# EAGLE board sr42-revB-kbd (EAGLE 9.6.2)
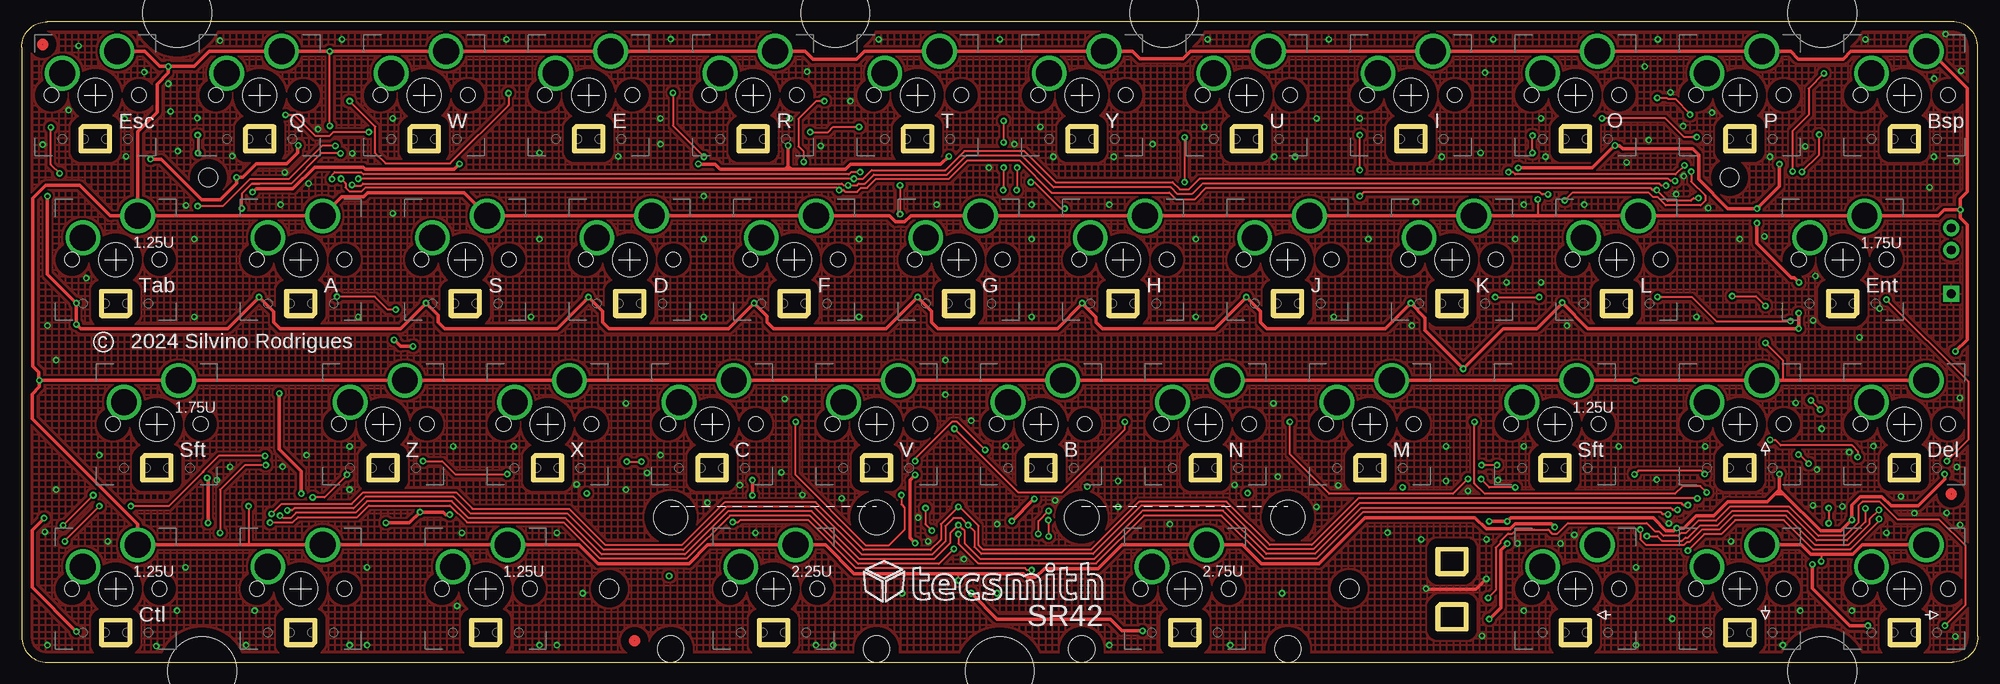
[diagram p3: board, top side]
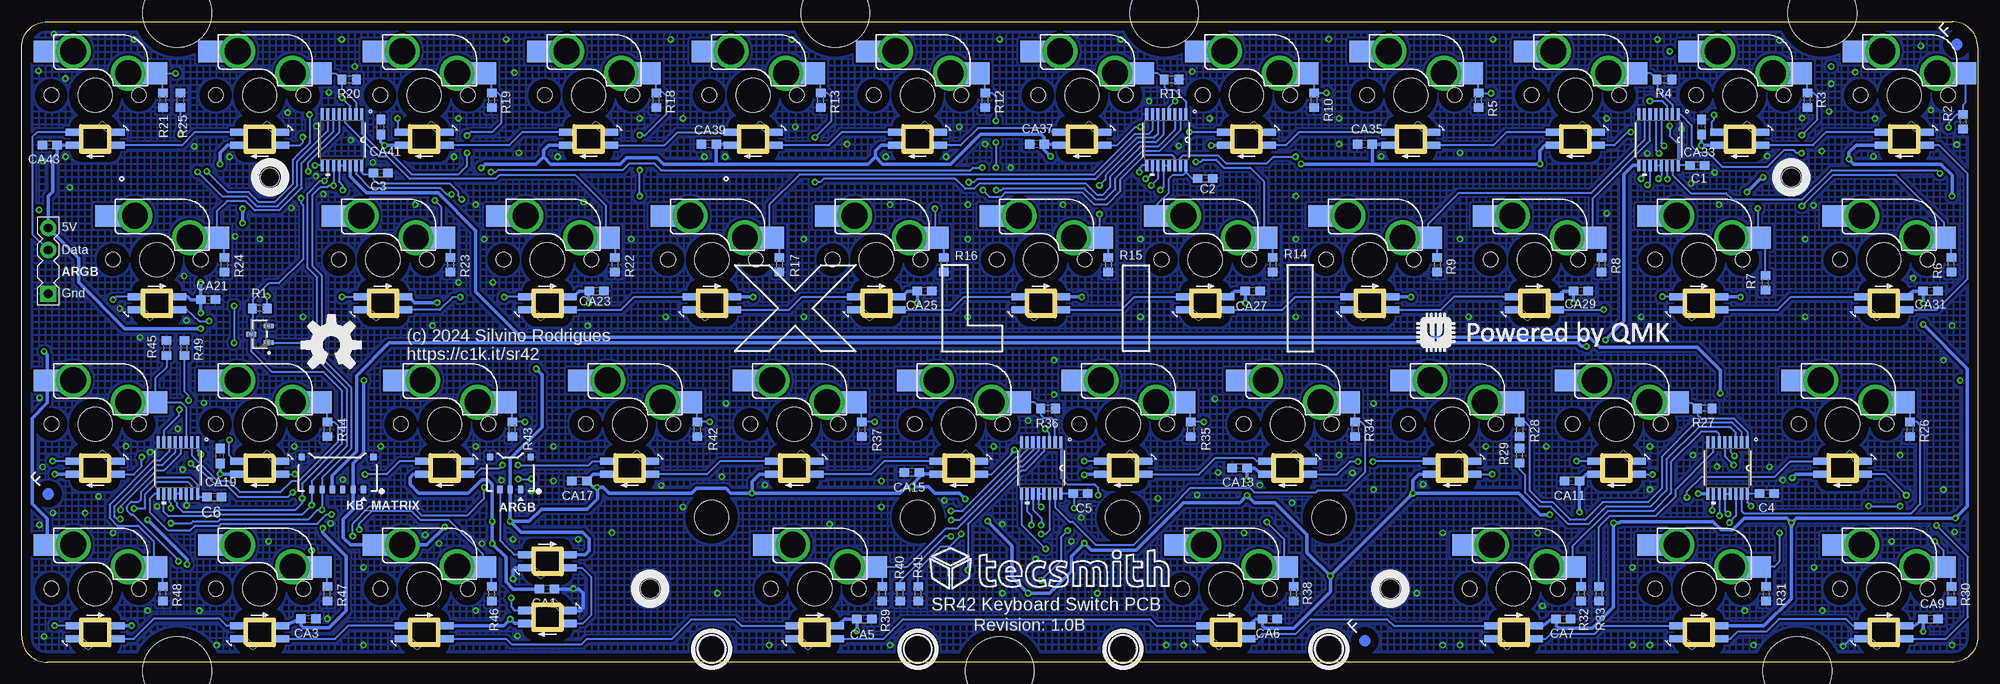
[diagram p4: board, bottom side, seen from below]

Size 226.6 x 74.2 mm. Coordinates in mm from the lower left corner, seen from the top.
Outline: 3,0 223.6,0 arc90 226.6,3 226.6,71.2 arc90 223.6,74.2 3,74.2 arc90 0,71.2 0,3 arc90 3,0
Copper layers (1*16): Top 0.035mm / dielectric 1.5mm / Bottom 0.035mm
Design rules "default *": minimum track width 6mil, minimum drill 0.35mm, track to track 10mil, track to pad 10mil, pad to pad 10mil, via to via 10mil, smd to smd 10mil, copper to edge 40mil, drill to drill 6mil, minimum pad ring 10mil, minimum via ring 8mil, stop-mask expansion 4mil, vias tented up to drill 0mil, thermal gap 10mil
Net classes: 2 gnd: width 0.254 mm
Holes 2.2 mm at 21.62,56.15 197.83,56.15 68.06,8.53 153.78,8.53
Holes 8 mm at 18.05,75.2 20.91,-1 94.25,75.2 113.3,-1 208.55,-1 208.55,75.2 132.35,75.2

## Footprints (pad centres in the part's own frame; a part is rotated, then mirrored left to right if it is on the bottom)
SK6812-E-MILL_V2 = smd 1.8 x 0.82 bottom: 1-VDD 2.5,-0.75; 2-DOUT 2.5,0.75; 3-GND -2.5,0.75; 4-DIN -2.5,-0.75
MOLEX_781710003 = smd 0.6 x 0.85: 1 -1.2,2; 2 0,2; 3 1.2,2 | smd 0.7 x 0.8: NC1 -2.35,-1.775; NC2 2.35,-1.775
C0603 = smd 1.1 x 1: 1 -0.85,0; 2 0.85,0
MX-STABS-200U = hole 3.988: -11.938,8.255; 11.938,8.255 | hole 3.048: -11.938,-6.985; 11.938,-6.985
ARGB = drill 1.016 pad 1.88: D 2.54,0; V 0,0 | drill 1.016 pad 1.88 square: G 7.62,0
MOLEX_781710006 = smd 0.6 x 0.85: 1 -3,2; 2 -1.8,2; 3 -0.6,2; 4 0.6,2; 5 1.8,2; 6 3,2 | smd 0.7 x 0.8: NC1 -4.15,-1.775; NC2 4.15,-1.775
TSSOP16 = smd 1.408 x 0.356: 1 -2.952,2.275; 2 -2.952,1.625; 3 -2.952,0.975; 4 -2.952,0.325; 5 -2.952,-0.325; 6 -2.952,-0.975; 7 -2.952,-1.625; 8 -2.952,-2.275; 9 2.952,-2.275; 10 2.952,-1.625; 11 2.952,-0.975; 12 2.952,-0.325; 13 2.952,0.325; 14 2.952,0.975; 15 2.952,1.625; 16 2.952,2.275
R0603 = smd 1 x 1.1: 1 -0.85,0; 2 0.85,0
MX-5-PIN-HOTSWAP-PAD = smd 3.15 x 2.5 bottom: 1@1 -6.785,2.54; 2@1 5.542,5.08 | drill 3 pad 3.75: 1@2 -3.81,2.54; 2@2 2.54,5.08 | hole 3.988: 0,0 | hole 1.7: -5.08,0; 5.08,0
TO-236AB_NEX = smd 0.533 x 1.168: 1 -0.953,-1.029; 2 0.953,-1.029; 3 0,1.029

## Placement (x,y rotation side)
A1  SK6812-E-REVERSE_V2  [SK6812-E-MILL_V2]  165.69,11.7 180 top
A1.5  SK6812-E-REVERSE_V2  [SK6812-E-MILL_V2]  165.69,5.25 0 top
A2  SK6812-E-REVERSE_V2  [SK6812-E-MILL_V2]  218.07,3.47 180 top
A3  SK6812-E-REVERSE_V2  [SK6812-E-MILL_V2]  199.03,3.47 180 top
A4  SK6812-E-REVERSE_V2  [SK6812-E-MILL_V2]  179.97,3.47 180 top
A5  SK6812-E-REVERSE_V2  [SK6812-E-MILL_V2]  134.73,3.47 180 top
A6  SK6812-E-REVERSE_V2  [SK6812-E-MILL_V2]  87.11,3.47 180 top
A7  SK6812-E-REVERSE_V2  [SK6812-E-MILL_V2]  53.77,3.47 180 top
A8  SK6812-E-REVERSE_V2  [SK6812-E-MILL_V2]  32.34,3.47 180 top
A9  SK6812-E-REVERSE_V2  [SK6812-E-MILL_V2]  10.91,3.47 180 top
A10  SK6812-E-REVERSE_V2  [SK6812-E-MILL_V2]  15.67,22.52 0 top
A11  SK6812-E-REVERSE_V2  [SK6812-E-MILL_V2]  41.86,22.52 0 top
A12  SK6812-E-REVERSE_V2  [SK6812-E-MILL_V2]  60.91,22.52 0 top
A13  SK6812-E-REVERSE_V2  [SK6812-E-MILL_V2]  79.96,22.52 0 top
A14  SK6812-E-REVERSE_V2  [SK6812-E-MILL_V2]  99.01,22.52 0 top
A15  SK6812-E-REVERSE_V2  [SK6812-E-MILL_V2]  118.06,22.52 0 top
A16  SK6812-E-REVERSE_V2  [SK6812-E-MILL_V2]  137.11,22.52 0 top
A17  SK6812-E-REVERSE_V2  [SK6812-E-MILL_V2]  156.16,22.52 0 top
A18  SK6812-E-REVERSE_V2  [SK6812-E-MILL_V2]  177.59,22.52 0 top
A19  SK6812-E-REVERSE_V2  [SK6812-E-MILL_V2]  199.03,22.52 0 top
A20  SK6812-E-REVERSE_V2  [SK6812-E-MILL_V2]  218.07,22.52 0 top
A21  SK6812-E-REVERSE_V2  [SK6812-E-MILL_V2]  210.93,41.58 180 top
A22  SK6812-E-REVERSE_V2  [SK6812-E-MILL_V2]  184.74,41.58 180 top
A23  SK6812-E-REVERSE_V2  [SK6812-E-MILL_V2]  165.69,41.58 180 top
A24  SK6812-E-REVERSE_V2  [SK6812-E-MILL_V2]  146.64,41.58 180 top
A25  SK6812-E-REVERSE_V2  [SK6812-E-MILL_V2]  127.59,41.58 180 top
A26  SK6812-E-REVERSE_V2  [SK6812-E-MILL_V2]  108.54,41.58 180 top
A27  SK6812-E-REVERSE_V2  [SK6812-E-MILL_V2]  89.49,41.58 180 top
A28  SK6812-E-REVERSE_V2  [SK6812-E-MILL_V2]  70.44,41.58 180 top
A29  SK6812-E-REVERSE_V2  [SK6812-E-MILL_V2]  51.39,41.58 180 top
A30  SK6812-E-REVERSE_V2  [SK6812-E-MILL_V2]  32.34,41.58 180 top
A31  SK6812-E-REVERSE_V2  [SK6812-E-MILL_V2]  10.91,41.58 180 top
A32  SK6812-E-REVERSE_V2  [SK6812-E-MILL_V2]  8.53,60.62 0 top
A33  SK6812-E-REVERSE_V2  [SK6812-E-MILL_V2]  27.57,60.62 0 top
A34  SK6812-E-REVERSE_V2  [SK6812-E-MILL_V2]  46.62,60.62 0 top
A35  SK6812-E-REVERSE_V2  [SK6812-E-MILL_V2]  65.67,60.62 0 top
A36  SK6812-E-REVERSE_V2  [SK6812-E-MILL_V2]  84.72,60.62 0 top
A37  SK6812-E-REVERSE_V2  [SK6812-E-MILL_V2]  103.78,60.62 0 top
A38  SK6812-E-REVERSE_V2  [SK6812-E-MILL_V2]  122.83,60.62 0 top
A39  SK6812-E-REVERSE_V2  [SK6812-E-MILL_V2]  141.88,60.62 0 top
A40  SK6812-E-REVERSE_V2  [SK6812-E-MILL_V2]  160.93,60.62 0 top
A41  SK6812-E-REVERSE_V2  [SK6812-E-MILL_V2]  179.97,60.62 0 top
A42  SK6812-E-REVERSE_V2  [SK6812-E-MILL_V2]  199.03,60.62 0 top
A43  SK6812-E-REVERSE_V2  [SK6812-E-MILL_V2]  218.07,60.62 0 top
ARGB  MOLEX_0781710003  [MOLEX_781710003]  170,22 180 bottom
C1  100nF  [C0603]  32.5,57.55 0 bottom
C2  100nF  [C0603]  89.5,56.05 0 bottom
C3  100nF  [C0603]  185,56.65 0 bottom
C4  100nF  [C0603]  24.45,19.55 0 bottom
C5  100nF  [C0603]  103.95,19.55 0 bottom
C6  100nF  [C0603]  204.3,19.15 0 bottom
CA1  1uF  [C0603]  165.76,8.48 0 bottom
CA3  1uF  [C0603]  193.38,5.05 0 bottom
CA5  1uF  [C0603]  129,5 0 bottom
CA6  1uF  [C0603]  82,5 0 bottom
CA7  1uF  [C0603]  48,5 0 bottom
CA9  1uF  [C0603]  5.5,5 0 bottom
CA11  1uF  [C0603]  47,21 180 bottom
CA13  1uF  [C0603]  85.5,22.5 180 bottom
CA15  1uF  [C0603]  123.5,22 180 bottom
CA17  1uF  [C0603]  162,21 180 bottom
CA19  1uF  [C0603]  203.6,23.9 90 bottom
CA21  1uF  [C0603]  205,42 0 bottom
CA23  1uF  [C0603]  160,43 0 bottom
CA25  1uF  [C0603]  122,43 0 bottom
CA27  1uF  [C0603]  84,43 0 bottom
CA29  1uF  [C0603]  46,43 0 bottom
CA31  1uF  [C0603]  5.5,43 0 bottom
CA33  1uF  [C0603]  32,62 90 bottom
CA35  1uF  [C0603]  71,60 180 bottom
CA37  1uF  [C0603]  109,60 180 bottom
CA39  1uF  [C0603]  147,60 180 bottom
CA41  1uF  [C0603]  185,62 90 bottom
CA43  1uF  [C0603]  223.33,59.9 180 bottom
H_SPC_1  MX-STABS-200U  [MX-STABS-200U]  87.11,8.53 0 top
H_SPC_2  MX-STABS-200U  [MX-STABS-200U]  134.73,8.53 0 top
I44  ARGB  [ARGB]  223.5,50.3 270 bottom
KB_MATRIX  MOLEX_0781710006  [MOLEX_781710006]  190,22 180 bottom
LOGO1  OSHW-LOGOL  [OSHW-LOGO-L]  190.71,36.76 0 bottom
M0  74HC589A_DT  [TSSOP16]  37,60.5 270 bottom
M1  74HC589A_DT  [TSSOP16]  94,60.5 270 bottom
M2  74HC589A_DT  [TSSOP16]  189.5,60.5 270 bottom
M3  74HC589A_DT  [TSSOP16]  29,22.5 270 bottom
M4  74HC589A_DT  [TSSOP16]  108.5,22.5 270 bottom
M5  74HC589A_DT  [TSSOP16]  208.5,22.5 270 bottom
R1  5.1K  [R0603]  199,41 0 bottom
R2  10K  [R0603]  1.7,62.6 90 bottom
R3  10K  [R0603]  19.75,65.1 90 bottom
R4  10K  [R0603]  36.3,67.5 180 bottom
R5  10K  [R0603]  57.85,65.1 90 bottom
R6  10K  [R0603]  3.08,46.05 270 bottom
R7  10K  [R0603]  24.61,43.95 270 bottom
R8  10K  [R0603]  43.56,46.05 270 bottom
R9  10K  [R0603]  62.61,46.05 270 bottom
R10  10K  [R0603]  76.9,65.1 90 bottom
R11  10K  [R0603]  93.4,67.5 180 bottom
R12  10K  [R0603]  115,65.1 90 bottom
R13  10K  [R0603]  134.05,65.1 90 bottom
R14  10K  [R0603]  81.66,46.05 270 bottom
R15  10K  [R0603]  100.71,46.05 270 bottom
R16  10K  [R0603]  119.76,46.05 270 bottom
R17  10K  [R0603]  138.81,46.05 270 bottom
R18  10K  [R0603]  153.1,65.1 90 bottom
R19  10K  [R0603]  172.15,65.1 90 bottom
R20  10K  [R0603]  188.65,67.5 180 bottom
R21  10K  [R0603]  210.25,65.1 90 bottom
R22  10K  [R0603]  157.86,46.05 270 bottom
R23  10K  [R0603]  176.91,46.05 270 bottom
R24  10K  [R0603]  203.11,46.05 270 bottom
R25  10K  [R0603]  208.2,65.1 90 bottom
R26  10K  [R0603]  7.84,27 90 bottom
R27  10K  [R0603]  31.65,29.41 180 bottom
R28  10K  [R0603]  53.09,27 90 bottom
R29  10K  [R0603]  53.1,23.95 270 bottom
R30  10K  [R0603]  3.08,7.95 270 bottom
R31  10K  [R0603]  24.51,7.95 270 bottom
R32  10K  [R0603]  45.94,7.95 270 bottom
R33  10K  [R0603]  43.9,7.95 270 bottom
R34  10K  [R0603]  72.14,27 90 bottom
R35  10K  [R0603]  91.19,27 90 bottom
R36  10K  [R0603]  107.7,29.41 180 bottom
R37  10K  [R0603]  129.29,27 90 bottom
R38  10K  [R0603]  79.28,7.95 270 bottom
R39  10K  [R0603]  126.91,7.95 270 bottom
R40  10K  [R0603]  124.85,7.95 270 bottom
R41  10K  [R0603]  122.75,7.95 270 bottom
R42  10K  [R0603]  148.34,27 90 bottom
R43  10K  [R0603]  169.77,27 90 bottom
R44  10K  [R0603]  191.2,27 90 bottom
R45  10K  [R0603]  209.8,36.4 270 bottom
R46  10K  [R0603]  172.15,7.95 270 bottom
R47  10K  [R0603]  191.2,7.95 270 bottom
R48  10K  [R0603]  210.25,7.95 270 bottom
R49  10K  [R0603]  207.75,36.4 90 bottom
SW_A  MX-5-PIN-HOTSWAP-PAD  [MX-5-PIN-HOTSWAP-PAD]  32.34,46.62 0 top
SW_B  MX-5-PIN-HOTSWAP-PAD  [MX-5-PIN-HOTSWAP-PAD]  118.06,27.57 0 top
SW_BSP  MX-5-PIN-HOTSWAP-PAD  [MX-5-PIN-HOTSWAP-PAD]  218.07,65.67 0 top
SW_C  MX-5-PIN-HOTSWAP-PAD  [MX-5-PIN-HOTSWAP-PAD]  79.96,27.57 0 top
SW_D  MX-5-PIN-HOTSWAP-PAD  [MX-5-PIN-HOTSWAP-PAD]  70.44,46.62 0 top
SW_DEL  MX-5-PIN-HOTSWAP-PAD  [MX-5-PIN-HOTSWAP-PAD]  218.07,27.57 0 top
SW_DN  MX-5-PIN-HOTSWAP-PAD  [MX-5-PIN-HOTSWAP-PAD]  199.03,8.53 0 top
SW_E  MX-5-PIN-HOTSWAP-PAD  [MX-5-PIN-HOTSWAP-PAD]  65.67,65.67 0 top
SW_ENT  MX-5-PIN-HOTSWAP-PAD  [MX-5-PIN-HOTSWAP-PAD]  210.93,46.62 0 top
SW_ESC  MX-5-PIN-HOTSWAP-PAD  [MX-5-PIN-HOTSWAP-PAD]  8.53,65.67 0 top
SW_F  MX-5-PIN-HOTSWAP-PAD  [MX-5-PIN-HOTSWAP-PAD]  89.49,46.62 0 top
SW_G  MX-5-PIN-HOTSWAP-PAD  [MX-5-PIN-HOTSWAP-PAD]  108.54,46.62 0 top
SW_H  MX-5-PIN-HOTSWAP-PAD  [MX-5-PIN-HOTSWAP-PAD]  127.59,46.62 0 top
SW_I  MX-5-PIN-HOTSWAP-PAD  [MX-5-PIN-HOTSWAP-PAD]  160.93,65.67 0 top
SW_J  MX-5-PIN-HOTSWAP-PAD  [MX-5-PIN-HOTSWAP-PAD]  146.64,46.62 0 top
SW_K  MX-5-PIN-HOTSWAP-PAD  [MX-5-PIN-HOTSWAP-PAD]  165.69,46.62 0 top
SW_L  MX-5-PIN-HOTSWAP-PAD  [MX-5-PIN-HOTSWAP-PAD]  184.74,46.62 0 top
SW_LA  MX-5-PIN-HOTSWAP-PAD  [MX-5-PIN-HOTSWAP-PAD]  53.77,8.53 0 top
SW_LC  MX-5-PIN-HOTSWAP-PAD  [MX-5-PIN-HOTSWAP-PAD]  10.91,8.53 0 top
SW_LF  MX-5-PIN-HOTSWAP-PAD  [MX-5-PIN-HOTSWAP-PAD]  179.97,8.53 0 top
SW_LS  MX-5-PIN-HOTSWAP-PAD  [MX-5-PIN-HOTSWAP-PAD]  15.67,27.57 0 top
SW_LW  MX-5-PIN-HOTSWAP-PAD  [MX-5-PIN-HOTSWAP-PAD]  32.34,8.53 0 top
SW_M  MX-5-PIN-HOTSWAP-PAD  [MX-5-PIN-HOTSWAP-PAD]  156.16,27.57 0 top
SW_N  MX-5-PIN-HOTSWAP-PAD  [MX-5-PIN-HOTSWAP-PAD]  137.11,27.57 0 top
SW_O  MX-5-PIN-HOTSWAP-PAD  [MX-5-PIN-HOTSWAP-PAD]  179.97,65.67 0 top
SW_P  MX-5-PIN-HOTSWAP-PAD  [MX-5-PIN-HOTSWAP-PAD]  199.03,65.67 0 top
SW_Q  MX-5-PIN-HOTSWAP-PAD  [MX-5-PIN-HOTSWAP-PAD]  27.57,65.67 0 top
SW_R  MX-5-PIN-HOTSWAP-PAD  [MX-5-PIN-HOTSWAP-PAD]  84.72,65.67 0 top
SW_RS  MX-5-PIN-HOTSWAP-PAD  [MX-5-PIN-HOTSWAP-PAD]  177.59,27.57 0 top
SW_RT  MX-5-PIN-HOTSWAP-PAD  [MX-5-PIN-HOTSWAP-PAD]  218.07,8.53 0 top
SW_S  MX-5-PIN-HOTSWAP-PAD  [MX-5-PIN-HOTSWAP-PAD]  51.39,46.62 0 top
SW_SPC_1  MX-5-PIN-HOTSWAP-PAD  [MX-5-PIN-HOTSWAP-PAD]  87.11,8.53 0 top
SW_SPC_2  MX-5-PIN-HOTSWAP-PAD  [MX-5-PIN-HOTSWAP-PAD]  134.73,8.53 0 top
SW_T  MX-5-PIN-HOTSWAP-PAD  [MX-5-PIN-HOTSWAP-PAD]  103.78,65.67 0 top
SW_TAB  MX-5-PIN-HOTSWAP-PAD  [MX-5-PIN-HOTSWAP-PAD]  10.91,46.62 0 top
SW_U  MX-5-PIN-HOTSWAP-PAD  [MX-5-PIN-HOTSWAP-PAD]  141.88,65.67 0 top
SW_UP  MX-5-PIN-HOTSWAP-PAD  [MX-5-PIN-HOTSWAP-PAD]  199.03,27.57 0 top
SW_V  MX-5-PIN-HOTSWAP-PAD  [MX-5-PIN-HOTSWAP-PAD]  99.01,27.57 0 top
SW_W  MX-5-PIN-HOTSWAP-PAD  [MX-5-PIN-HOTSWAP-PAD]  46.62,65.67 0 top
SW_X  MX-5-PIN-HOTSWAP-PAD  [MX-5-PIN-HOTSWAP-PAD]  60.91,27.57 0 top
SW_Y  MX-5-PIN-HOTSWAP-PAD  [MX-5-PIN-HOTSWAP-PAD]  122.83,65.67 0 top
SW_Z  MX-5-PIN-HOTSWAP-PAD  [MX-5-PIN-HOTSWAP-PAD]  41.86,27.57 0 top
U1  2N7002  [TO-236AB_NEX]  199,38 90 bottom
U$1  SR42_MLB_FOOTPRINT  [SR42_MLB_FOOTPRINT]  170.45,59.2 0 top
U$2  UBD_FOOTPRINT  [UDB_FOOTPRINT]  113.3,65 0 top
U$3  TECSMITH-LOGOLONG  [TECSMITH-NAME]  119,11 0 bottom
U$4  QMK_LOGO  [QMK_LOGO]  65.14,35.86 0 bottom
U$5  FIDUCIAL  [FIDUCIAL]  2.45,71.55 0 top
U$6  FIDUCIAL  [FIDUCIAL]  223.5,19.5 0 top
U$7  FIDUCIAL  [FIDUCIAL]  71,2.5 0 top
U$8  TECSMITH-LOGOLONG  [TECSMITH-NAME]  99.9,9.5 0 top

## Tracks (layer width: path | path; a pad name or v marks a point on that pad's centre or on a via)
CS_MTX  (via drill 0.35)
  Top 0.254: v193,18.2 192.5,18.2 192.24,18.46 155.01,18.46 149.65,13.1 144.35,13.1 139.34,18.11 129.66,18.11 124.1,12.55 111.17,12.55 110.35,13.37 110.35,15.2 v109.65,15.9 108.85,16.7 107.93,16.7 107,15.77 107,14 105.47,12.47 97.32,12.47 91.77,18.02 81.63,18.02 76.63,13.02 67.42,13.02 63.22,17.22 52,17.22 50.04,19.18 39.79,19.18 38.46,17.84 31.59,17.84 31.34,17.59 v30.79,17.59 | v39,56 v96.4,56 97.45,56 98.45,57 107,57 109.2,59.2 116.15,59.2 119.74,55.61 133.33,55.61 134.17,54.77 135.2,54.77 136.43,56 190.75,56 191,55.75 v191.5,55.75
  Bottom 0.254: U1.1 197.92,37 193,37 | M5.10 210.12,17.45 209.57,16.9 204.03,16.9 203.8,17.13 194.07,17.13 v193,18.2 KB_MATRIX.6 193,20.98 188.94,25.04 188.94,31.66 192.36,35.08 192.36,36.35 193,36.99 193,37 | M4.10 110.12,17.48 109.65,17 v109.65,15.9 | 193,37 192.36,37.64 192.36,44.61 193.47,45.72 193.47,54.28 192,55.75 v191.5,55.75 191.12,56.12 M2.10 | v30.79,17.59 30.79,18.09 30.62,18.25 M3.10 | M0.10 38.62,56.38 v39,56 | M1.10 95.62,56.64 96.25,56 v96.4,56
GND  (via drill 0.35)
  Top 0.406: v169.66,9.67 168.47,8.48 162.71,8.48 v162.66,8.53
  Bottom 0.254: M5.14 207.53,18.19 v207.5,18.17 207.48,18.15 | v15.6,1.88 14.75,2.73 A9.3-GND
  Bottom 0.406: CA1.2 162.71,8.48 | 162.71,8.48 v162.66,8.53 | A1.3-GND 169.36,10.95 169.66,10.64 v169.66,9.67 | A1.5.3-GND 161.85,6 161.54,6.31 161.54,7.98 162.04,8.48 162.71,8.48
  other vias: 30.5,56.75 34.35,61.75 192.45,62.1 185.91,57.91 92.55,59.8 79,54 79,49 79,40 75.19,72.17 88.4,30.5 70,30 70,20 65,8 167.55,19.85 161.5,53.3 169.5,68.3 181,53 174,53 176,63 172,44 176,44 179,39 161.03,39 136,49 152,40 136,40 145,30 145.5,21.5 150,18 127,18 158.21,15.02 178.24,13.76 185,25 195,25 187,11 187,2 204,2 206,6 212,6 224,3 219.24,17.29 174,25 171,21.1 165,25 165,21 126,53 117,53 112.05,57.3 106,53 117,49 117,40 17,67 19.05,52.93 30,53 20,49 20,40 39,40 43,52 59,40 60,49 97,40 97,49 156,49 173,49 199,49 194,40 133,16 113,16 114,25 109.15,11.95 113,8 102,8 126,2 85,15 105,14 62,15 51,15 50.45,6.55 40,11 19,11 27,6 26,2 2.7,15.1 10,14 4,20 9,24 4,35 3,39 7.5,44.5 38,20 38,25 33,24 30.24,22.67 72.45,21.95 79.45,18.5 88,22 95,19 90.45,19.4 119.7,18.75 127,21 140.5,20.55 152.5,20.5 169.69,14.24 176.5,58.55 202.5,58.55 164.5,58.55 145.1,58.55 147.5,58.55 126.5,58.55 119.5,58.55 115,60 69.1,58.6 74,60 12.1,58.6 38.3,58.95 74,63 150,63 155,63 191,66 221.5,58.55 221,55 208.5,27.05 206.6,59.75 43,63 3,2 18.1,59.19 60,59 137,62 118,62 169,59 188,69 224.1,58.05 214.5,25.05 205.5,30.05 57,25 50,25 60,2 38,2 40,2 62,2 18,6 92,2 94,2 2.45,59.95 17.26,63.81 5.45,63.95 33.25,55.45 207.95,22.32 210.9,18.05 195.8,63.65 74,24 169.17,3.07 174,6 107,31 107,35 103.85,16.75 140,2 146,8 189.4,21.15 89,63 91,68.4 96,65 211.7,24.35 110,28 131,60 198,14 216,15 190.8,16.1 191.2,5.05 207.79,44.74 188.48,60.48 215.22,40.98 212.89,37.64 64.29,20.62 83.19,20.52 207.5,39.6 173.26,13.76 179.86,14.76 201.88,49.34 221.53,67.6 213.57,72.13 189.52,72.13 170.47,72.13 151.42,72.13 137.37,72.13 113.32,72.13 99.27,72.13 56.17,72.13 37.12,72.13 23,72 14.22,68.34 6.6,71.39 222.98,17.31 162.12,14.24 224.55,15.91 224.17,22.62 224.5,30.62 24.14,22.64 22.62,21.09 20.36,63.02 217.69,19.21 11.93,62.97 224.65,68.48 222.86,72.75 195.36,52.61 192.51,56.32 191.66,54.21 24.42,58.63
  pour Top (isolate 0.254, hatched): 226,2 224,0 3,0 0,3 0,71 3,74 224,74 226,72
  pour Bottom (isolate 0.254, hatched): 226,2 224,0 3,0 0,3 0,71 3,74 224,74 226,72
K00  (via drill 0.35)
  Top 0.254: v4.42,56.63 3.4,57.65 v3.4,61.95
  Bottom 0.254: SW_ESC.1@2 2,68.22 | 2,68.22 SW_ESC.1@1 | 2,68.22 1.43,67.64 1.43,64.84 1.7,64.57 R2.2 2.45,63.45 3.4,62.5 v3.4,61.95 | M0.15 35.38,56.45 33.27,54.35 29.18,54.35 28.43,53.6 20.35,53.6 16.95,57 4.78,57 v4.42,56.63
K01  (via drill 0.35)
  Top 0.254: v20.45,58.98 20.45,59.09 20.4,59.15 v20.4,61.05
  Bottom 0.254: SW_Q.1@2 SW_Q.1@1 19.75,67.17 R3.2 19.05,65.95 18.6,65.5 18.6,62.85 v20.4,61.05 | M0.1 34.42,63.45 33.17,62.2 33.17,59.83 32.4,59.05 31.27,59.05 29.6,57.38 24.39,57.38 22.42,59.36 21.4,59.36 21.02,58.98 v20.45,58.98
K02
  Bottom 0.254: SW_W.1@2 SW_W.1@1 37.87,68.22 R4.2 37.15,66.35 35.38,64.58 M0.2
K03  (via drill 0.35)
  Top 0.254: v56.4,65.9 56.4,64.53 49.65,57.78 42.15,57.78 40.97,58.97 40.97,62.03 v38,65
  Bottom 0.254: SW_E.1@2 SW_E.1@1 58.22,68.22 57.85,67.85 R5.2 57.8,65.9 v56.4,65.9 | M0.3 36.02,64.46 36.55,65 v38,65
K04  (via drill 0.35)
  Top 0.254: v36.35,59.8 34.8,59.8 30.96,55.97 26.43,55.97 23.3,52.84 v20.4,52.84
  Bottom 0.254: SW_TAB.1@2 SW_TAB.1@1 3.98,49.02 | R6.1 3.08,48.12 3.98,49.02 | M0.4 36.67,60.12 v36.35,59.8 | 3.98,49.02 3.98,50.97 9.5,56.49 16.74,56.49 v20.4,52.84
K05  (via drill 0.35)
  Top 0.254: v36.95,58.95 34.7,58.95 31.2,55.45 27.57,55.45 | 26.7,55.45 27.57,55.45 | v25.51,52.57 25.51,54.26 26.68,55.42 27.55,55.42 27.57,55.45
  Bottom 0.254: SW_A.1@2 SW_A.1@1 24.61,48.23 R7.1 | M0.5 37.33,59.33 v36.95,58.95 | v25.51,52.57 25.51,49.2
  Bottom 0.305: 25.51,49.2 SW_A.1@1
K06
  Bottom 0.254: SW_S.1@2 SW_S.1@1 | R8.1 43.56,48.12 SW_S.1@1 | M0.6 37.98,60.39 44.6,53.77 SW_S.1@1
K07
  Bottom 0.254: SW_D.1@2 SW_D.1@1 | R9.1 62.61,48.12 SW_D.1@1 | M0.7 38.62,60.5 44.77,54.35 60.09,54.35 63.65,50.8 SW_D.1@1
K10  (via drill 0.35)
  Top 0.254: v75.45,65.95 75.45,62.15 v79.05,58.55
  Bottom 0.254: SW_R.1@2 SW_R.1@1 77.22,68.22 76.9,67.9 R10.2 v75.45,65.95 | M1.15 92.38,58.42 92.08,58.72 88.04,58.72 87.1,57.78 82.35,57.78 82.07,58.07 81.58,58.55 v79.05,58.55
K11
  Bottom 0.254: SW_T.1@2 SW_T.1@1 94.97,68.22 R11.2 94.25,66.65 93.9,66.3 93.08,66.3 91.72,64.94 M1.1
K12  (via drill 0.35)
  Top 0.254: v113.75,62.7 v113.75,60.2 | v113.75,57.28 113.75,54.73 v113.7,54.67
  Bottom 0.254: SW_Y.1@2 SW_Y.1@1 115,67.17 R12.2 114.2,65.95 113.75,65.5 v113.75,62.7 | M1.2 92.38,61.62 94.79,59.21 96.75,59.21 99.95,56.01 99.95,54.77 101.12,53.6 102.21,53.6 103.54,54.93 112.87,54.93 113.12,54.67 v113.7,54.67 | v113.75,60.2 v113.75,57.28
K13  (via drill 0.35)
  Top 0.254: v134.7,60.8 v134.7,55.6
  Bottom 0.254: SW_U.1@2 SW_U.1@1 134.05,67.17 R13.2 133.3,65.95 132.85,65.5 132.85,62.65 v134.7,60.8 | M1.3 93.03,61.69 95,59.72 97,59.72 100.51,56.21 100.51,55 101.4,54.11 102,54.11 103.33,55.43 115.68,55.43 116.28,54.84 117.29,54.84 118.43,55.98 133.72,55.98 134.1,55.6 v134.7,55.6
K14  (via drill 0.35)
  Top 0.254: v93,65 92.05,65 89.99,62.94 89.99,59.76 90.59,59.16 v90.59,57.96
  Bottom 0.254: SW_F.1@2 SW_F.1@1 | R14.1 81.66,48.12 SW_F.1@1 | M1.4 93.67,64.33 v93,65 | v90.59,57.96 90.04,57.96 89.79,58.21 88.25,58.21 87.31,57.27 84.28,57.27 82.7,55.7 SW_F.1@1
K15  (via drill 0.35)
  Top 0.254: v101.75,55.23 v101.75,51.9
  Bottom 0.254: SW_G.1@2 SW_G.1@1 | R15.1 100.71,48.12 SW_G.1@1 | M1.5 94.33,61.11 95.21,60.22 97.21,60.22 101.05,56.39 101.05,55.92 v101.75,55.23 | v101.75,51.9 SW_G.1@1
K16  (via drill 0.35)
  Top 0.254: v116.89,55.59 117.34,55.59 120.4,52.54 v120.8,52.54
  Bottom 0.254: SW_H.1@2 SW_H.1@1 | R16.1 119.76,48.12 SW_H.1@1 | M1.6 94.97,61.18 95.42,60.73 97.42,60.73 102.21,55.94 115.95,55.94 116.3,55.59 v116.89,55.59 | v120.8,52.54 SW_H.1@1
K17
  Bottom 0.254: SW_J.1@2 140,49.16 | 140,49.16 SW_J.1@1 138.81,48.12 R17.1 | M1.7 95.62,61.62 96,61.24 97.63,61.24 102.38,56.49 136.51,56.49 140,53 140,49.16
K20  (via drill 0.35)
  Top 0.254: v176.8,54.18 176.12,54.18 175.87,54.43 155.43,54.43 v155,54 | v155,57 v155,61.05
  Bottom 0.254: SW_I.1@2 SW_I.1@1 153.1,67.17 153.1,66 | R18.2 153.1,66 | M2.15 187.88,56.58 186.25,54.95 178.13,54.95 177.36,54.18 v176.8,54.18 | 153.1,66 152.35,66 151.9,65.55 151.9,63.55 154.4,61.05 v155,61.05 | v155,54 v155,57
K21  (via drill 0.35)
  Top 0.254: v175,59 v175,61
  Bottom 0.254: SW_O.1@2 SW_O.1@1 172.15,67.17 R19.2 171.45,65.95 171,65.5 171,62.5 172.05,61.45 174.55,61.45 v175,61 | M2.1 187.22,61.29 184.99,59.06 183.99,59.06 181.44,56.51 176,56.51 175,57.51 v175,59
K22
  Bottom 0.254: M2.2 187.88,64.88 189.5,66.5 R20.2 190.22,68.22 SW_P.1@1 SW_P.1@2
K23  (via drill 0.35)
  Top 0.254: v205.15,56.85 205.12,56.88 205.12,61.52 207,63.4 207,66.45 v208.75,68.2 | v189.45,65.37 190.55,65.37 190.69,65.24 191.56,65.24 193.25,63.55 v193.25,63.43
  Bottom 0.254: SW_BSP.1@2 SW_BSP.1@1 | R21.2 210.25,67.17 SW_BSP.1@1 | M2.3 188.53,64.42 189.45,65.35 v189.45,65.37 | v193.25,63.43 193.25,60.14 194.56,58.83 195.16,58.22 195.16,55.41 197.23,53.34 199.17,53.34 200.28,54.45 202.75,54.45 v205.15,56.85 | SW_BSP.1@1 208.76,68.22 v208.75,68.2
K24
  Bottom 0.254: M2.4 189.18,62.52 185.2,58.55 184.2,58.55 181.65,56 171.7,56 171.3,56.4 162.4,56.4 158.9,52.9 SW_K.1@1 | SW_K.1@1 SW_K.1@2 | SW_K.1@1 157.85,48.11 157.85,46.91 R22.1
K25  (via drill 0.35)
  Top 0.254: v178.75,53.5 v178.75,53.51 179.64,54.39 188.47,54.39 188.96,53.91 189.46,53.91 190.43,52.93 194.49,52.93 195,53.44 195,54.06 193.39,55.67 v193.39,56.83
  Bottom 0.254: SW_L.1@2 SW_L.1@1 177.95,49.95 | 177.95,49.95 177.95,52.7 v178.75,53.5 | M2.5 189.82,61.4 193.39,57.84 v193.39,56.83 | R23.1 176.91,48.91 177.95,49.95
K26
  Bottom 0.254: SW_ENT.1@2 SW_ENT.1@1 203.99,49.01 | R24.1 203.11,48.12 203.99,49.01 | M2.6 190.47,61.48 194.15,57.8 194.15,54.95 196.77,52.33 199.59,52.33 200.67,53.4 202.8,53.4 203.99,52.21 203.99,49.01
K27  (via drill 0.35)
  Top 0.254: v206.21,56.8 208.2,58.79 v208.2,61.1
  Bottom 0.254: M2.7 191.12,61.54 194.66,58.01 194.66,55.18 197,52.84 199.38,52.84 200.47,53.92 203.33,53.92 v206.21,56.8 | R25.1 v208.2,61.1
K30
  Bottom 0.254: SW_LS.1@2 SW_LS.1@1 7.84,29.07 R26.2 7.05,27.85 6.65,27.45 6.65,18.35 7.72,17.28 27.11,17.28 27.38,17.56 M3.15
K31
  Bottom 0.254: SW_Z.1@2 SW_Z.1@1 34.98,30.02 33.11,30.02 R27.2 32.5,28.7 32.05,28.25 28.25,28.25 26.73,26.73 M3.1
K32
  Bottom 0.254: SW_X.1@2 SW_X.1@1 53.09,29.07 R28.2 52.45,27.85 51.9,27.3 51.9,19.9 50.54,18.54 49.25,18.54 47.22,16.51 45.49,16.51 43.46,18.54 38.25,18.54 36.62,20.17 36.62,23.83 32.71,27.74 28.46,27.74 27.38,26.66 M3.2
K33
  Bottom 0.254: M3.3 28.02,26.59 28.67,27.23 32.35,27.23 36.06,23.52 36.06,19.91 37.94,18.03 43.09,18.03 45.12,16 47.43,16 49.46,18.03 50.78,18.03 52.45,19.7 52.45,21.7 53.1,22.35 R29.2
K34  (via drill 0.35)
  Top 0.254: v12.65,18.1 17.03,18.1 20.96,22.04 21.09,22.16 22.83,23.9 v28.2,23.9 | v9,18.1 5,14.1 v5,14
  Bottom 0.254: SW_LC.1@2 SW_LC.1@1 4.03,10.97 | R30.1 3.08,10.03 4.03,10.97 | v12.65,18.1 v9,18.1 | v5,14 4,13 4,11 4.03,10.97 | M3.4 28.68,24.38 v28.2,23.9
K35  (via drill 0.35)
  Top 0.254: v28.28,22.85 25.85,22.85 23,20 v23,15
  Bottom 0.254: SW_LW.1@2 SW_LW.1@1 | R31.1 24.51,10.03 SW_LW.1@1 | M3.5 29.32,23.89 v28.28,22.85 | SW_LW.1@1 23.59,11.06 23,11.65 v23,15
K36
  Bottom 0.254: SW_LA.1@2 SW_LA.1@1 | R32.1 45.94,10.03 SW_LA.1@1 | M3.6 29.98,26.4 30.3,26.73 32.06,26.73 35.55,23.23 35.55,19.57 37.6,17.52 42.88,17.52 46.98,13.42 SW_LA.1@1
K37
  Bottom 0.254: M3.7 30.62,24.38 35,20.01 35,19.26 37.28,16.97 42.63,16.97 43.9,15.7 R33.1
K40
  Bottom 0.254: SW_C.1@2 SW_C.1@1 72.14,29.07 R34.2 71.45,27.85 70.95,27.35 70.95,22.05 73.08,19.92 76.47,19.92 76.7,19.68 83.81,19.68 84.32,20.2 91.2,20.2 92.19,19.21 92.19,19.19 97.75,13.64 102.19,13.64 104.85,16.3 105.2,16.3 106.88,17.98 M4.15
K41  (via drill 0.35)
  Top 0.254: v101.91,19.36 101.91,18.3 102.28,17.93 102.28,15.38 100.42,13.52 97.83,13.52 89.65,21.7 v89.65,27.85
  Bottom 0.254: SW_V.1@2 SW_V.1@1 91.19,29.07 R35.2 v89.65,27.85 | M4.1 106.22,21.35 105.53,20.65 102.31,20.65 101.91,20.25 v101.91,19.36
K42
  Bottom 0.254: SW_B.1@2 SW_B.1@1 109.25,30.11 R36.2 108.55,28.65 108.15,28.25 107.25,28.25 106.88,27.88 M4.2
K43  (via drill 0.35)
  Top 0.254: v108.05,27.05 115.42,19.68 120.48,19.68 127.8,27 v127.8,27.85
  Bottom 0.254: SW_N.1@2 SW_N.1@1 129.29,29.07 R37.2 v127.8,27.85 | M4.3 107.53,26.52 v108.05,27.05
K44  (via drill 0.35)
  Top 0.254: v117,10.69 116.46,10.69 116.25,10.9 96.68,10.9 91.09,16.49 83.27,16.49 83.01,16.24 v82.36,16.24
  Bottom 0.254: SW_SPC_1.1@2 SW_SPC_1.1@1 | R38.1 79.28,10.03 SW_SPC_1.1@1 | M4.4 108.17,24.43 110.4,22.19 110.79,22.19 117,15.98 v117,10.69 | v82.36,16.24 80.32,14.2 SW_SPC_1.1@1
K45
  Bottom 0.254: SW_SPC_2.1@2 128,11.06 | 128,11.06 SW_SPC_2.1@1 123.98,11.06 119.55,15.5 118.2,15.5 111,22.7 110.61,22.7 108.83,24.49 M4.5 | R39.1 126.91,9.97 128,11.06
K46  (via drill 0.35)
  Top 0.254: v118.94,16.46 118.94,14.61 v118.95,14.6
  Bottom 0.254: M4.6 109.47,24.57 110.78,23.25 111.17,23.25 117.95,16.46 v118.94,16.46 | R40.1 124.85,9.42 119.67,14.6 v118.95,14.6
K47  (via drill 0.35)
  Top 0.254: v117.76,14.87 117.76,16.36 v118.95,17.55
  Bottom 0.254: M4.7 110.12,24.62 110.95,23.8 111.34,23.8 117.59,17.55 v118.95,17.55 | R41.1 122.75,10.75 120.08,13.42 119.06,13.42 117.76,14.72 v117.76,14.87
K50  (via drill 0.35)
  Top 0.254: v173,20.27 170,20.27 v169.06,21.21 | v167.54,21.25 165.8,19.51 155.07,19.51 155.06,19.52 151.48,19.52 146.9,24.1 v146.9,27.85 | v213.56,17.84 213.56,16.27 211.43,14.13 207.92,14.13 204.56,17.49 198.07,17.49 196.45,15.87 194.42,15.87 193,14.46 192.71,14.46 192.37,14.11 189.99,14.11 189.48,14.62 v188.25,14.62
  Bottom 0.254: SW_M.1@2 SW_M.1@1 148.34,29.07 R42.2 v146.9,27.85 | M5.15 206.88,20.43 207.35,20.9 210.85,20.9 212.26,19.49 212.26,17.91 212.34,17.84 v213.56,17.84 | v188.25,14.62 188.25,16.07 186.27,18.05 181.26,18.05 180.21,17 175,17 173,19 v173,20.27 | v169.06,21.21 167.58,21.21 v167.54,21.25
K51  (via drill 0.35)
  Top 0.254: v205.8,24.05 205.95,24.05 v207,23 | v195.18,19.68 194.46,20.4 192.4,20.4 191.51,19.51 169.49,19.51 168.3,20.7 v168.3,27.85
  Bottom 0.254: SW_RS.1@2 SW_RS.1@1 169.77,29.07 R43.2 v168.3,27.85 | M5.1 206.22,24.48 v205.8,24.05 | v207,23 206.65,22.65 206.25,22.65 204.08,20.48 202.84,20.48 201.51,19.15 195.71,19.15 v195.18,19.68
K52
  Bottom 0.254: SW_UP.1@2 SW_UP.1@1 191.2,29.07 R44.2 190.4,27.85 190.01,27.46 190.01,25.51 194.52,21 195.34,21 196.65,19.68 201.28,19.68 202.6,21 203.87,21 206.88,24 M5.2
K53
  Bottom 0.254: SW_DEL.1@1 211.09,29.92 211.09,32.91 209.8,34.2 R45.2 | SW_DEL.1@2 SW_DEL.1@1 | SW_DEL.1@1 208.12,30.11 207.53,29.52 M5.3
K54  (via drill 0.35)
  Top 0.254: v215.13,17.64 215.11,17.64 214.07,16.6 214.07,16.06 211.64,13.63 207.71,13.63 204.35,16.98 198.28,16.98 196.66,15.37 194.63,15.37 193.21,13.95 192.92,13.95 192.58,13.6 188.15,13.6 187.47,14.28 v187.47,15.37
  Bottom 0.254: R46.1 172.15,10.03 SW_LF.1@1 | SW_LF.1@2 SW_LF.1@1 | M5.4 208.18,24.18 210.15,22.21 211.01,22.21 215.13,18.09 v215.13,17.64 | v187.47,15.37 187.47,16.05 185.98,17.54 181.47,17.54 180.42,16.49 177.13,16.49 173.19,12.55 SW_LF.1@1
K55  (via drill 0.35)
  Top 0.254: v193,12.95 194.91,14.86 196.87,14.86 198.49,16.48 204.14,16.48 207.5,13.12 211.85,13.12 215.15,16.42 v215.15,16.6
  Bottom 0.254: SW_DN.1@1 191.2,10.03 R47.1 | SW_DN.1@1 SW_DN.1@2 | M5.5 208.82,24.3 210.31,22.82 211.12,22.82 215.89,18.05 215.89,16.94 215.55,16.6 v215.15,16.6 | v193,12.95 193,11.82 SW_DN.1@1
K56
  Bottom 0.254: R48.1 210.25,10.03 SW_RT.1@1 | SW_RT.1@2 SW_RT.1@1 | M5.6 209.47,24.43 210.58,23.32 211.33,23.32 216.4,18.25 216.4,16.73 215.51,15.84 213.16,15.84 213.15,15.85 211.29,14 SW_RT.1@1
K57  (via drill 0.35)
  Top 0.254: v208.34,29.26 v207.26,30.34
  Bottom 0.254: M5.7 210.13,25.46 210.13,26.81 208.34,28.61 v208.34,29.26 | v207.26,30.34 207.26,30.9 207.75,31.39 R49.1
LATCH_MTX  (via drill 0.35)
  Top 0.254: v194.1,19 154.83,19 149.44,13.61 144.59,13.61 139.58,18.62 129.45,18.62 123.89,13.06 111.38,13.06 110.86,13.58 110.86,15.82 108.66,18.01 v108.51,18.01 v108.5,18 106.49,15.99 106.49,14.21 105.3,13.02 97.52,13.02 91.97,18.57 81.43,18.57 76.43,13.57 67.62,13.57 63.42,17.77 52.23,17.77 50.32,19.68 39.58,19.68 38.25,18.35 30.1,18.35 v28.95,17.2 | v37,56 37.53,55.47 37.53,54.97 37.97,54.53 39.38,54.53 39.79,54.94 94.45,54.94 v94.71,54.69 95.21,54.69 95.42,54.48 96.79,54.48 97.25,54.94 97.95,54.94 98.99,55.98 107.42,55.98 109.53,58.09 115.62,58.09 119.31,54.4 132.95,54.4 133.7,53.65 135.91,53.65 137.2,54.94 188.66,54.94 188.91,54.69 v189.39,54.69 190.64,53.44 193.36,53.44 193.67,53.75 v194.23,53.75
  Bottom 0.254: M5.13 M5.12 208.82,18.68 208.56,18.42 208.56,18.07 207.9,17.41 204.24,17.41 204.01,17.64 194.9,17.64 194.1,18.44 v194.1,19 194.1,20.7 189.5,25.3 189.5,31.5 191.65,33.65 197.65,33.65 200.03,36.03 U1.3 200.03,39.67 199.85,39.85 R1.1 199.85,42 197.97,43.88 196.82,43.88 194.01,46.69 194.01,52.95 194.23,53.17 v194.23,53.75 | M2.13 M2.12 189.82,55.62 189.39,55.19 v189.39,54.69 | M1.13 M1.12 94.33,55.07 v94.71,54.69 | M0.12 M0.13 36.67,56.33 v37,56 | M3.13 M3.12 29.32,17.57 v28.95,17.2 | M4.13 M4.12 108.83,18.32 v108.5,18
MATRIX_0_1  (via drill 0.35)
  Top 0.254: v97.12,56.76 96.09,56.76 95.83,56.51 39.57,56.51 39.31,56.76 36.26,56.76 35.96,56.46 v35.96,55.96
  Bottom 0.254: M1.9 96.8,57.55 97.12,57.23 v97.12,56.76 | M0.14 36.02,56.02 v35.96,55.96
MATRIX_1_2  (via drill 0.35)
  Top 0.254: v192.6,57.55 192.6,57.53 191.57,56.51 173,56.51 172.74,56.77 v172.24,56.77 | v115.3,57.28 115.3,54.73 v115.25,54.67
  Bottom 0.254: M2.9 v192.6,57.55 | v172.24,56.77 171.69,56.77 171.45,57 157,57 156.23,57.77 153.27,57.77 152.5,57 116.68,57 116.4,57.28 v115.3,57.28 | M1.14 93.03,58.42 93.3,58.7 96.54,58.7 99.37,55.87 99.37,54.53 100.84,53.06 102.39,53.06 103.75,54.42 112.61,54.42 113.12,53.92 114.51,53.92 115.25,54.65 v115.25,54.67
MATRIX_2_3  (via drill 0.35)
  Top 0.406: v32.4,19.55 32.4,22.15 29.85,24.7 v29.85,31.15
  Bottom 0.406: M2.14 188.53,56.27 186.62,54.37 178.37,54.37 174,50 174,42.9 168.76,37.66 45,37.66 43.82,36.48 32.48,36.48 29.85,33.85 v29.85,31.15 | v32.4,19.55 M3.9
MATRIX_3_4  (via drill 0.35)
  Top 0.254: v108,13.15 106.26,11.41 96.89,11.41 91.3,17 82.05,17 77.05,12 67,12 62.8,16.2 51.58,16.2 49.62,18.16 40.21,18.16 38.88,16.82 32.01,16.82 31.39,16.2 v28.8,16.2 v28.79,16.19
  Bottom 0.254: M4.9 110.78,15.93 v108,13.15 | M3.14 28.02,16.95 v28.79,16.19
MATRIX_4_5  (via drill 0.35)
  Top 0.254: v108.5,14.85 108.5,13.75 110.8,11.45 124.45,11.45 130,17 139,17 144,12 150,12 155.36,17.36 189.91,17.36 190.12,17.14 v190.69,17.14
  Bottom 0.254: M4.14 107.53,15.32 108,14.85 v108.5,14.85 | v190.69,17.14 191.24,17.14 192.34,16.04 203.45,16.04 203.65,15.84 206.51,15.84 207.05,15.3 209.7,15.3 211.75,17.36 211.75,18.95 211.15,19.55 M5.9
MISO  (via drill 0.35)
  Top 0.406: v45.35,36.6 43.9,36.6 v43.15,37.35
  Bottom 0.406: KB_MATRIX.4 190.6,21.64 187.8,24.44 187.8,33.2 184,37 46.35,37 45.95,36.6 v45.35,36.6 | v43.15,37.35 41,39.5 41,56.5 39.95,57.55 M0.9
N$1
  Bottom 0.254: ARGB.3 171.2,14.13 170.4,13.34 169.62,12.55 169.52,12.45 A1.4-DIN
N$2
  Bottom 0.254: A43.2-DOUT 224.8,61.38 225.34,60.84 225.34,49.6 I44.D
N$3  (via drill 0.35)
  Top 0.254: v8.3,19.35 v4.8,15.85
  Bottom 0.254: A9.2-DOUT 3.68,2.72 1.15,5.25 1.15,12.2 v4.8,15.85 | v8.3,19.35 10.73,21.78 A10.4-DIN
N$4
  Bottom 0.254: A32.2-DOUT 17.62,61.38 19.12,59.88 24,59.88 24.53,59.88 A33.4-DIN
N$5  (via drill 0.35)
  Top 0.254: v30.57,63.4 31.6,63.4 34.05,60.95 35.65,60.95 36.1,61.4 v40.21,61.4
  Bottom 0.254: v30.57,63.4 30.57,62.85 30.82,62.6 30.82,61.83 30.37,61.38 A33.2-DOUT | v40.21,61.4 40.6,61.4 42.12,59.88 A34.4-DIN
N$6
  Bottom 0.254: A34.2-DOUT 54.62,61.38 56.12,59.88 62,59.88 62.63,59.88 A35.4-DIN
N$7
  Bottom 0.254: A35.2-DOUT 78.62,61.38 80.12,59.88 81,59.88 81.68,59.88 A36.4-DIN
N$8  (via drill 0.35)
  Top 0.254: v91.35,61.4 93.4,61.4 94,62 v97,62
  Bottom 0.254: v97,62 97.6,62 99.72,59.88 A37.4-DIN | v91.35,61.4 91.33,61.38 A36.2-DOUT
N$9  (via drill 0.35)
  Top 0.254: v222.77,4.26 225.17,6.67 225.17,13.47 222.12,16.52 217.32,16.52 215.25,18.59 213.22,18.59 212.76,18.13 212.76,16.19 211.22,14.64 208.13,14.64 204.77,18 197.86,18 196.24,16.38 194.21,16.38 192.79,14.97 192.19,14.97 191.87,14.65 190.17,14.65 189.69,15.13 189.25,15.13 188.25,16.13 179.13,16.13 177.91,14.91 177.28,14.91 176.83,15.36 175.21,15.36 173.14,15.36 172.68,14.89 172.17,14.89 171.78,14.5 171.33,14.05 171.33,13.86 170.76,13.29 170.76,8.36 169.88,7.48 v169.89,7.46
  Bottom 0.254: A2.4-DIN 222.73,4.22 v222.77,4.26 | v169.89,7.46 169.89,6.42 169.47,6 A1.5.2-DOUT
N$10
  Bottom 0.254: A1.2-DOUT 161.68,10.95 160.64,9.91 160.64,5.43 161.57,4.5 A1.5.4-DIN
N$11
  Bottom 0.254: A37.2-DOUT 107.2,61.38 107.7,61.88 115.82,61.88 117.82,59.88 119,59.88 119.78,59.88 A38.4-DIN
N$12
  Bottom 0.254: A38.2-DOUT 131.62,61.38 133.12,59.88 138,59.88 138.83,59.88 A39.4-DIN
N$13
  Bottom 0.254: A39.2-DOUT 150.62,61.38 152.12,59.88 A40.4-DIN
N$14
  Bottom 0.254: A23.2-DOUT 157.18,40.82 155.68,42.32 151,42.32 149.68,42.32 A24.4-DIN
N$15
  Bottom 0.254: A24.2-DOUT 137.73,40.82 136.23,42.32 131,42.32 130.63,42.32 A25.4-DIN
N$16
  Bottom 0.254: A25.2-DOUT 118.93,40.82 117.43,42.32 112,42.32 111.58,42.32 A26.4-DIN
N$17
  Bottom 0.254: A26.2-DOUT 99.18,40.82 97.68,42.32 93,42.32 92.53,42.32 A27.4-DIN
N$18
  Bottom 0.254: A27.2-DOUT 80.58,40.82 79.08,42.32 74,42.32 73.48,42.32 A28.4-DIN
N$20  (via drill 0.35)
  Top 0.254: v43.35,40.85 42.4,40.85 40.9,42.35 v36.54,42.35
  Bottom 0.254: A30.4-DIN 36.54,42.32 v36.54,42.35 | A29.2-DOUT 43.38,40.82 v43.35,40.85
N$21
  Bottom 0.254: A30.2-DOUT 23.18,40.82 21.68,42.32 15,42.32 13.95,42.32 A31.4-DIN
N$22  (via drill 0.35)
  Top 0.254: v216,42 225.46,32.54 225.46,25.76 v223,23.3
  Bottom 0.254: A20.2-DOUT 222.98,23.28 v223,23.3 | A21.4-DIN 215.68,42.32 v216,42
N$23  (via drill 0.35)
  Top 0.254: v37.71,21.73 35.09,19.11 v33.72,19.11
  Bottom 0.254: A11.4-DIN 37.76,21.78 v37.71,21.73 | v33.72,19.11 33.72,19.79 32.01,21.5 23.5,21.5 21.72,23.28 18.71,23.28 A10.2-DOUT
N$24  (via drill 0.35)
  Top 0.254: v46.5,23.3 48.7,23.3 50.2,21.8 v56.25,21.8
  Bottom 0.254: A11.2-DOUT 46.48,23.28 v46.5,23.3 | A12.4-DIN 58.19,21.8 v56.25,21.8
N$25  (via drill 0.35)
  Top 0.254: v70.1,23.25 v71.8,23.25
  Bottom 0.254: A12.2-DOUT 70.07,23.28 v70.1,23.25 | v71.8,23.25 72.75,23.25 74.22,21.78 A13.4-DIN
N$26
  Bottom 0.254: A13.2-DOUT 83.51,23.28 83.91,23.68 88.32,23.68 90.22,21.78 A14.4-DIN
N$27  (via drill 0.35)
  Top 0.254: v111.6,24.6 108.35,27.85 107.77,27.85 103.5,23.58 v103.5,23.3
  Bottom 0.254: v111.6,24.6 111.95,24.25 111.95,24.11 114.28,21.78 A15.4-DIN | A14.2-DOUT 103.48,23.28 v103.5,23.3
N$28
  Bottom 0.254: A15.2-DOUT 126.72,23.28 128.22,21.78 133,21.78 134.07,21.78 A16.4-DIN
N$29
  Bottom 0.254: A16.2-DOUT 145.72,23.28 147.22,21.78 153,21.78 153.12,21.78 A17.4-DIN
N$30
  Bottom 0.254: A40.2-DOUT 168.62,61.38 170.12,59.88 176,59.88 176.93,59.88 A41.4-DIN
N$31
  Bottom 0.254: A5.2-DOUT 126.78,2.72 124.5,5 95.9,5 95.12,4.22 91,4.22 90.15,4.22 A6.4-DIN
N$32
  Bottom 0.254: A6.2-DOUT 83.51,2.73 82.91,3.33 78.98,3.32 77.3,5 68.45,5 67.67,4.22 A7.4-DIN
N$33
  Bottom 0.254: A7.2-DOUT 50.07,2.73 49.47,3.33 44.38,3.32 43.48,4.22 35.38,4.22 A8.4-DIN
N$34
  Bottom 0.254: A8.2-DOUT 28.69,2.73 27.81,3.6 24.48,3.6 23,5.07 15.32,5.07 14.47,4.22 A9.4-DIN
N$36
  Bottom 0.254: A31.2-DOUT 4.78,40.82 1.2,44.4 1.2,56.6 4.48,59.88 5,59.88 5.48,59.88 A32.4-DIN
N$40  (via drill 0.35)
  Top 0.254: v202.53,25.75 203.12,25.75 203.75,25.12 212.03,25.12 212.68,24.47 v212.68,23.76
  Bottom 0.254: A19.2-DOUT 201.83,23.28 202.53,23.98 v202.53,25.75 | A20.4-DIN 213.61,21.78 212.68,22.71 v212.68,23.76
N$41  (via drill 0.35)
  Top 0.254: v194.03,60.81 192.57,60.81 190.38,63.01 v183.06,63.01 v183.05,63
  Bottom 0.254: v183.05,63 183.03,62.98 183.03,61.73 A41.2-DOUT | A42.4-DIN 194.33,59.88 194.03,60.18 v194.03,60.81
N$42
  Bottom 0.254: A28.2-DOUT 62.18,40.82 60.68,42.32 55,42.32 54.43,42.32 A29.4-DIN
N$47
  Bottom 0.254: A42.2-DOUT 206.52,61.38 208.02,59.88 215,59.88 215.03,59.88 A43.4-DIN
N$48  (via drill 0.35)
  Top 0.254: v189.48,42.32 193.48,42.32 196.28,39.52 v204.87,39.53
  Bottom 0.254: A21.2-DOUT 207.5,40.83 206,39.52 v204.87,39.53 | v189.48,42.32 187.78,42.32 A22.4-DIN
N$49  (via drill 0.35)
  Top 0.254: v170.7,42.3 v175.8,42.3
  Bottom 0.254: A23.4-DIN 170.68,42.32 v170.7,42.3 | v175.8,42.3 176.7,42.3 178.18,40.82 181,40.82 181.69,40.82 A22.2-DOUT
N$50
  Bottom 0.254: A2.2-DOUT 213.6,2.73 211.23,5.1 203.69,5.1 202.82,4.22 A3.4-DIN
N$51
  Bottom 0.254: A3.2-DOUT 190.28,2.72 188.78,4.22 A4.4-DIN
N$52
  Bottom 0.254: A4.2-DOUT 170.45,2.73 169.82,2.1 161.74,2.1 161.12,2.72 151.28,2.72 149,5 144,5 143.22,4.22 137.77,4.22 A5.4-DIN
N$54  (via drill 0.35)
  Top 0.254: v170.88,22.85 v169.11,22.85
  Bottom 0.254: A18.4-DIN 174.07,21.78 173.36,22.49 171.24,22.49 v170.88,22.85 | v169.11,22.85 v169.1,22.84 160.91,22.84 160.47,23.28 A17.2-DOUT
N$55  (via drill 0.35)
  Top 0.254: v186.82,21.78 187.25,22.2 194.56,22.2 v194.96,21.8
  Bottom 0.254: A18.2-DOUT 182.79,23.28 184.29,21.78 v186.82,21.78 | A19.4-DIN 194.98,21.78 v194.96,21.8
SCK  (via drill 0.35)
  Top 0.254: v209.32,17.86 v209.32,16.11 | v191.8,17.65 191.25,17.65 191,17.9 155.18,17.9 149.83,12.56 144.17,12.56 139.17,17.56 129.83,17.56 124.28,12 111,12 109.26,13.74 109.26,15.16 108.81,15.61 108.79,15.61 v108.5,15.9 108.21,15.61 108.19,15.61 107.55,14.97 107.55,13.8 105.71,11.96 97.06,11.96 91.51,17.51 81.84,17.51 76.84,12.51 67.21,12.51 63.01,16.71 51.79,16.71 49.83,18.67 40,18.67 38.67,17.33 31.8,17.33 31.18,16.71 30.29,16.71 30,17 v29.95,17 | v38.29,55.29 38.37,55.2 39.3,55.2 39.55,55.45 95.02,55.45 95.23,55.24 v95.73,55.24 96.79,55.24 97,55.45 97.67,55.45 98.71,56.49 107.21,56.49 109.37,58.65 115.88,58.65 119.53,55 133.12,55 133.91,54.21 135.56,54.21 136.8,55.45 189.7,55.45 189.94,55.21 v190.46,55.21
  Bottom 0.254: M5.11 209.47,18.61 209.32,18.46 v209.32,17.86 | v209.32,16.11 209.3,16.09 206.98,16.09 206.72,16.35 203.86,16.35 203.62,16.59 193.36,16.59 192.3,17.65 v191.8,17.65 KB_MATRIX.5 191.8,21.36 188.43,24.73 188.43,31.87 191.85,35.28 191.85,44.82 192,44.97 192,45 192.94,45.94 192.94,54.06 192.01,54.99 191.19,54.99 190.96,55.21 v190.46,55.21 190.47,55.23 M2.11 | M4.11 109.47,17.7 108.49,16.71 v108.49,15.91 v108.5,15.9 | M3.11 29.97,19.54 29.97,17.02 v29.95,17 | M0.11 37.99,57.54 37.99,55.59 v38.29,55.29 | v95.73,55.24 v95.73,55.25 94.97,56.01 M1.11
VCC_1  (via drill 0.35)
  Top 0.406: v50.73,57.72 50.13,57.11 39.79,57.11 39.56,57.34 33.92,57.34 31.42,54.84 27.16,54.84 v26.76,54.44 | v78.39,57.72 78.44,57.66 80.33,57.66 80.91,57.09 88.44,57.09 | v173.35,57.27 181.92,57.27 184.5,59.85 v184.55,59.85 185.07,59.85 185.46,59.47 193.56,59.47 194.26,58.76 194.26,55.92 197.64,52.54 v201,52.54 203.6,55.14 v203.6,57.7 | v205.85,40.45 v205.85,38.65 v205.84,38.66 181.44,38.66 v178.45,41.65 178.45,41.6 175.5,38.66 171.66,38.66 v167,34 162.57,38.43 162.57,39.93 v160.9,41.6 157.96,38.66 144.23,38.66 143.52,39.37 143.52,40.63 v141.85,42.3 138.21,38.66 125.18,38.66 124.47,39.37 124.47,39.98 v122.85,41.6 122.85,41.51 120,38.66 106.13,38.66 105.42,39.37 105.42,40.68 v103.8,42.3 100.16,38.66 87.08,38.66 86.37,39.37 86.37,40.08 v84.85,41.6 81.91,38.66 68.03,38.66 67.32,39.37 67.32,40.63 v65.65,42.3 62.01,38.66 48.98,38.66 48.27,39.37 48.27,40.18 v46.85,41.6 43.91,38.66 29.93,38.66 29.22,39.37 29.22,40.58 v27.5,42.3 23.86,38.66 6.84,38.66 v6.35,39.15 v6.35,41.6 3,44.95 v3,54 | v6.35,3.55 1.22,8.68 1.22,15.32 v2.6,16.7 | v129.85,3.65 127.45,3.65 126.1,5 113,5 v110,8 | v103.5,21.7 102.9,21.1 102.9,14.4 v103.5,13.8 | 204.07,19.53 208.37,15.23 210.73,15.23 v212,16.5 212,18.2 213,19.2 215.47,19.2 216.55,18.12 219.67,18.12 222.75,21.2 v222.75,21.8 | 204.07,19.53 203.6,20 | v203.6,21.8 203.6,20 | v32.05,59.85 32,59.8 32,59 30.72,57.72 27.19,57.72 25.63,56.16 v24.9,56.16 24.9,55.49 22.99,53.59 20.84,53.59 16.16,58.27 v14.93,58.27 | v21.6,16.15 21.6,21.25 v21.5,21.35 | v49.6,17.1 49.1,17.1 48.8,17.4 v46.15,17.4 44.9,16.15 v42.2,16.15
  Top 0.406: v84.65,21.1 v84.65,19.34 | v117.3,18.92 117.27,18.92 v114.7,16.35 | 203.13,19.53 202.21,18.61 197.64,18.61 196,16.97 193.97,16.97 192.55,15.55 v191.7,15.55 191.38,15.23 190.46,15.23 188.98,16.72 172.5,16.72 v172.09,16.31 v170,16.31 | 203.13,19.53 203.6,20 | v3,54 | v107.4,58.6 106.47,57.66 96,57.66 95.43,57.09 89.16,57.09 | v207.44,11.35 207.44,8.56 211.75,4.25 v213.86,4.25 | v205.88,44 205.34,44.53 204.98,44.53 201,48.52 v201,50.87 | v172.09,13.74 171.34,12.99 171.34,6.34 v170,5 | 204.07,19.53 203.13,19.53 | v88.8,59.85 88.8,57.45 | 88.8,57.45 88.44,57.09 | 88.8,57.45 89.16,57.09 | 89.16,57.09 88.44,57.09
  Bottom 0.406: A33.1-VDD 32.02,59.88 | 32.02,59.88 v32.05,59.85 | v78.39,57.72 78.38,57.71 70.15,57.71 | 70.15,57.71 v50.74,57.71 v50.73,57.72 50.75,57.73 50.75,59.27 50.14,59.88 A34.1-VDD | A36.1-VDD 88.77,59.88 v88.8,59.85 | 146.15,57.7 152.25,57.7 153,58.45 156.55,58.45 157.3,57.7 165.3,57.7 166.15,58.55 | v173.35,57.27 172.92,57.7 167,57.7 166.15,58.55 | A41.1-VDD 184.52,59.88 v184.55,59.85 185,60.3 CA41.1 | v205.85,38.65 v205.85,38.66 214.66,38.66 220,44 220,46.8 I44.V 223.5,54 223,54.5 223,58.4 222.48,58.92 CA43.1 220.65,59.91 A43.1-VDD | A22.1-VDD 181.72,42.32 181.05,41.65 v178.45,41.65 | A24.1-VDD 141.87,42.32 v141.85,42.3 | A26.1-VDD 103.82,42.32 v103.8,42.3 | A28.1-VDD 65.67,42.32 v65.65,42.3 | A30.1-VDD 27.52,42.32 v27.5,42.3 | v3,54 3,56.4 4.31,57.71 14.37,57.71 v14.93,58.27 14.93,59.05 14.11,59.88 12.62,59.88 A32.1-VDD | v6.35,39.15 1.22,34.02 1.22,18.08 v2.6,16.7 21.05,16.7 v21.6,16.15 | v142,19.61 144.45,19.61 144.99,20.14 148.43,20.14 148.99,19.58 158.54,19.58 159.23,20.27 v159.95,20.27 | A8.1-VDD 24.78,4.22 21.61,7.39 21.61,14.61 21.6,14.61 v21.6,16.15 | A14.1-VDD 103.42,21.78 v103.5,21.7 | A16.1-VDD 141.12,21.78 142,20.9 v142,19.61 | A17.1-VDD 160.37,21.78 CA17.1 160.42,20.27 v159.95,20.27 | A4.1-VDD 171.78,4.22 170.78,4.22 v170,5 169.5,4.5 A1.5.1-VDD | v167,34 166.3,33.3 166.3,27.25 170,23.55 ARGB.2 v170,16.31 | A18.1-VDD 181.22,21.78 181.6,21.4 181.6,20.6 180.61,19.61 174.85,19.61 173.31,21.15 172.6,21.15 172.1,20.65 v172.1,16.32 v172.09,16.31 v172.09,13.74 170.5,12.15 170.5,9.32 169.65,8.48 CA1.1 | A19.1-VDD 203.58,21.78 v203.6,21.8 CA19.1 | v191.7,15.55 191.7,15 189,12.3 189,6 190.97,4.03 193.97,4.03 194.23,4.29 CA3.1 194.4,5.05 196.05,4.22 A3.1-VDD
  Bottom 0.406: v21.6,16.15 22.15,16.7 27.06,16.7 28.4,15.35 29.74,15.35 30.68,16.3 41.4,16.3 41.55,16.15 v42.2,16.15 42.2,6.4 44.65,3.95 48.55,3.95 48.85,4.25 CA7.1 49.42,5 50.4,4.22 A7.1-VDD | v21.5,21.35 21.07,21.78 18.79,21.78 18.81,21.8 18.39,21.8 A10.1-VDD | v49.6,17.1 50.68,17.1 53.18,19.61 65.39,19.61 65.42,19.57 | v117.3,18.92 117.98,19.61 120.78,19.61 121.53,20.36 v123.44,20.36 | v114.7,16.35 111.88,13.53 111.88,9.88 v110,8 107.55,8 105,10.55 105,12.3 v103.5,13.8 102.7,13 97.5,13 91.99,18.51 85.48,18.51 v84.65,19.34 83.82,18.51 81.44,18.51 77.72,14.78 77.72,12.72 v75,10 | 127.7,58.55 126.85,57.7 118.98,57.7 115.53,61.15 108.5,61.15 108.15,60.8 CA37.1 | v129.85,3.65 CA5.1 131.25,5 A5.1-VDD | v6.35,3.55 CA9.1 6.38,5 7.35,4.22 A9.1-VDD | A11.1-VDD 45.37,21.78 CA11.1 v46.15,17.4 | v84.65,21.1 CA13.1 83.75,22.5 83.08,21.83 82.71,21.83 A13.1-VDD | A15.1-VDD 120.81,21.82 122.47,21.82 CA15.1 122.65,21.38 123.44,20.59 v123.44,20.36 | A21.1-VDD 207.33,42.32 207.01,42 CA21.1 | v205.85,40.45 CA21.1 | A6.1-VDD 83.63,5 CA6.1 82.85,4.25 82.58,3.97 79.22,3.97 75,8.2 v75,10 | v160.9,41.6 160.9,42.95 CA23.1 162,43 162.68,42.32 A23.1-VDD | v122.85,41.6 CA25.1 124,43 124.68,42.32 A25.1-VDD | v84.85,41.6 CA27.1 86.11,43 A27.1-VDD | v46.85,41.6 CA29.1 48.01,43 A29.1-VDD | A31.1-VDD 7.53,43 CA31.1 v6.35,41.6 | CA33.1 32.02,61.13 32.02,59.88 | A35.1-VDD 68.5,60 CA35.1 70.15,57.71 | v107.4,58.6 108.15,59.35 CA37.1 | 146.15,57.7 CA39.1 144.7,60 A39.1-VDD | 127.7,58.55 127.7,59.25 127.07,59.88 A38.1-VDD | 127.7,58.55 128.55,57.7 146.15,57.7 | 166.15,58.55 166.15,59.3 165.57,59.88 A40.1-VDD
  Bottom 0.406: A42.1-VDD 202.72,59.88 203.6,59 v203.6,57.7 | A20.1-VDD 220.8,21.8 v222.75,21.8 | A37.1-VDD 106.6,60 CA37.1 | A12.1-VDD 64.77,21.78 65.45,21.1 v65.45,19.57 65.42,19.57 | v212,16.5 207.44,11.94 v207.44,11.35 | A2.1-VDD 213.89,4.22 v213.86,4.25 | v75,10 65.42,19.57 | v123.44,20.36 124.08,20.36 124.83,19.61 v142,19.61 | CA21.1 205.85,43.98 v205.88,44 | v201,50.87 v201,52.54 | v170,16.31 168.76,15.07 161.62,15.07 160.88,14.34 160.88,12.91 161.33,12.45 A1.1-VDD | v159.95,20.27 159.9,20.22 159.9,18.93 161.09,17.74 166.38,17.74 167.81,16.31 v170,16.31 | v26.76,54.44 25.05,56.16 v24.9,56.16
VCC_2  (via drill 0.35)
  Top 0.254: SW_LA.2@2 56,13.61 | v35.69,62.12 v35.69,70.75 | v175.61,53.61 175.61,51.77 175.55,51.7 | v26.3,18.1 26.3,13.61 | v104.7,17.85 104.7,16 v105.45,15.25 | v108.5,9.5 108.5,10.22 108.55,10.27 | 208.4,12.5 208.45,12.45 v208.45,11.7 | v198.15,42.4 200.88,42.4 v202,41.28 | v202,37 204,35 204,32.66
  Top 0.406: SW_ESC.2@2 14.24,70.75 16,69 v17,69 | v17,69 20,69 21.75,70.75 SW_Q.2@2 v35.69,70.75 SW_W.2@2 SW_E.2@2 SW_R.2@2 90.74,70.75 91.67,69.83 96.74,69.83 97.67,70.75 SW_T.2@2 SW_Y.2@2 128.69,70.75 129.56,69.88 134.51,69.88 135.39,70.75 SW_U.2@2 SW_I.2@2 SW_O.2@2 SW_P.2@2 204.91,70.75 205.81,69.86 210.99,69.86 211.89,70.75 SW_BSP.2@2 221.06,70.75 225.36,66.46 225.36,54.5 224.57,53.71 v224.57,52.4 | SW_DEL.2@2 204,32.66 SW_UP.2@2 v186.95,32.66 SW_RS.2@2 SW_M.2@2 SW_N.2@2 SW_B.2@2 SW_V.2@2 SW_C.2@2 SW_X.2@2 SW_Z.2@2 SW_LS.2@2 v2.06,32.66 | SW_TAB.2@2 SW_A.2@2 37.08,53.91 39.65,53.91 40.1,54.36 51.27,54.36 SW_S.2@2 SW_D.2@2 SW_F.2@2 100.55,51.7 101.25,51 102.3,51 103,51.7 SW_G.2@2 SW_H.2@2 SW_J.2@2 SW_K.2@2 175.55,51.7 SW_L.2@2 SW_ENT.2@2 222,51.7 222.69,52.4 v224.57,52.4 | SW_RT.2@2 213.2,13.61 212.09,12.5 208.4,12.5 207.25,12.5 206.15,13.61 SW_DN.2@2 | SW_TAB.2@2 10.29,51.7 6.76,55.24 2.81,55.24 1.3,53.73 1.3,34.29 2,33.59 2,32.71 v2.06,32.66 | SW_TAB.2@2 13.45,61.45 15.7,63.7 15.7,66.95 17,68.25 v17,69 | v224,36 225.36,37.36 225.36,50.68 224.57,51.47 v224.57,52.4 | v2.06,32.66 2.06,31.89 1.22,31.05 1.22,28.23 13.45,16 SW_LC.2@2 26.3,13.61 SW_LW.2@2 56,13.61 64.57,13.61 66.76,11.42 77.29,11.42 79.48,13.61 SW_SPC_1.2@2 93.09,13.61 96.43,10.27 108.55,10.27 116.05,10.27 116.47,9.86 117.45,9.86 118.47,10.87 124.69,10.87 127.43,13.61 SW_SPC_2.2@2 141.4,13.61 143.58,11.42 150.24,11.42 155.6,16.77 168.36,16.77 169.65,15.48 172.44,15.48 173.02,16.05 177.21,16.05 v177.59,15.67
  Bottom 0.254: SW_W.2@2 SW_W.2@1 | SW_E.2@2 SW_E.2@1 | SW_R.2@2 SW_R.2@1 | SW_T.2@2 SW_T.2@1 | SW_Y.2@2 SW_Y.2@1 | SW_U.2@2 SW_U.2@1 | SW_I.2@2 SW_I.2@1 | SW_O.2@2 SW_O.2@1 | SW_P.2@2 SW_P.2@1 | SW_BSP.2@2 SW_BSP.2@1 | SW_ENT.2@1 SW_ENT.2@2 | SW_L.2@1 SW_L.2@2 | SW_K.2@1 SW_K.2@2 | SW_J.2@1 SW_J.2@2 | SW_H.2@1 SW_H.2@2 | SW_G.2@1 SW_G.2@2 | SW_F.2@2 SW_F.2@1 95.03,53.09 93.72,54.41 93.72,55.98 93.24,56.46 92.04,56.46 91.75,56.75 | SW_D.2@1 SW_D.2@2 | SW_S.2@1 SW_S.2@2 | SW_A.2@1 SW_A.2@2 | SW_TAB.2@1 SW_TAB.2@2 | SW_ESC.2@2 SW_ESC.2@1 | SW_Q.2@2 SW_Q.2@1 | SW_LS.2@2 SW_LS.2@1 | SW_Z.2@2 SW_Z.2@1 | SW_X.2@2 SW_X.2@1 | SW_C.2@2 SW_C.2@1 | SW_V.2@2 SW_V.2@1 | SW_B.2@2 SW_B.2@1 | SW_N.2@2 SW_N.2@1 | SW_M.2@2 SW_M.2@1 | SW_RS.2@2 SW_RS.2@1 | SW_UP.2@2 SW_UP.2@1 | SW_DEL.2@2 SW_DEL.2@1 223.6,32.67 | SW_RT.2@1 SW_RT.2@2 | SW_SPC_2.2@1 SW_SPC_2.2@2 | SW_SPC_1.2@1 SW_SPC_1.2@2 | SW_LA.2@1 SW_LA.2@2 | SW_LW.2@1 SW_LW.2@2 | SW_LC.2@1 SW_LC.2@2 | C1.1 M0.16 34.73,60 35.69,60.97 v35.69,62.12 | M1.16 91.72,56.78 91.75,56.75 | C6.1 206.22,19.15 M5.16 206.22,20.54 207.09,21.41 211.09,21.41 212.77,19.73 212.77,18.86 213.01,18.62 213.88,18.62 214.35,18.15 214.35,17.55 213.87,17.08 213.65,17.08 208.45,11.88 v208.45,11.7 | SW_LF.2@2 SW_LF.2@1 | SW_DN.2@2 SW_DN.2@1 | v175.61,53.61 176.04,54.04 176.04,54.5 177.01,55.46 185.35,55.46 185.85,55.96 C3.1 185.95,56.55 187.05,56.55 187.22,56.73 M2.16 | C4.1 M3.16 26.73,18.52 v26.3,18.1 | v108.5,9.5 106.22,11.78 106.22,14.47 v105.45,15.25 | M4.16 C5.1 104.7,19.45 v104.7,17.85 | 91.75,56.75 91.05,56.05 C2.1 | R1.2 v198.15,42.4 | v202,41.28 v202,37
  Bottom 0.406: SW_RT.2@1 223.62,16.62 225.37,18.37 225.37,28.29 223.62,30.05 SW_DEL.2@1 | 223.6,32.67 223.6,35.6 v224,36 | v186.95,32.66 186.99,32.62 186.99,24.26 188.2,23.05 KB_MATRIX.2 188.2,17.7 189.35,16.55 189.35,14.45 188.5,13.61 SW_LF.2@1 | v177.59,15.67 179.66,13.61 SW_LF.2@2

## Text on the board
tPlace: 2024 Silvino Rodrigues | SR42
bPlace: (c) 2024 Silvino Rodrigues / https://c1k.it/sr42 | SR42 Keyboard Switch PCB | Revision: 1.0B
tNames: Esc | Q | W | E | R | T | Y | U | I | O | P | Bsp | 1.25U | 1.75U | Tab | A | S | D | F | G | H | J | K | L | Ent | 1.75U | 1.25U | Sft | Z | X | C | V | B | N | M | Sft | Del | 1.25U | 1.25U | 2.25U | 2.75U | Ctl
bNames: 5V | Data | ARGB | Gnd